# EAGLE design oak_pcb (EAGLE 7.2.0)
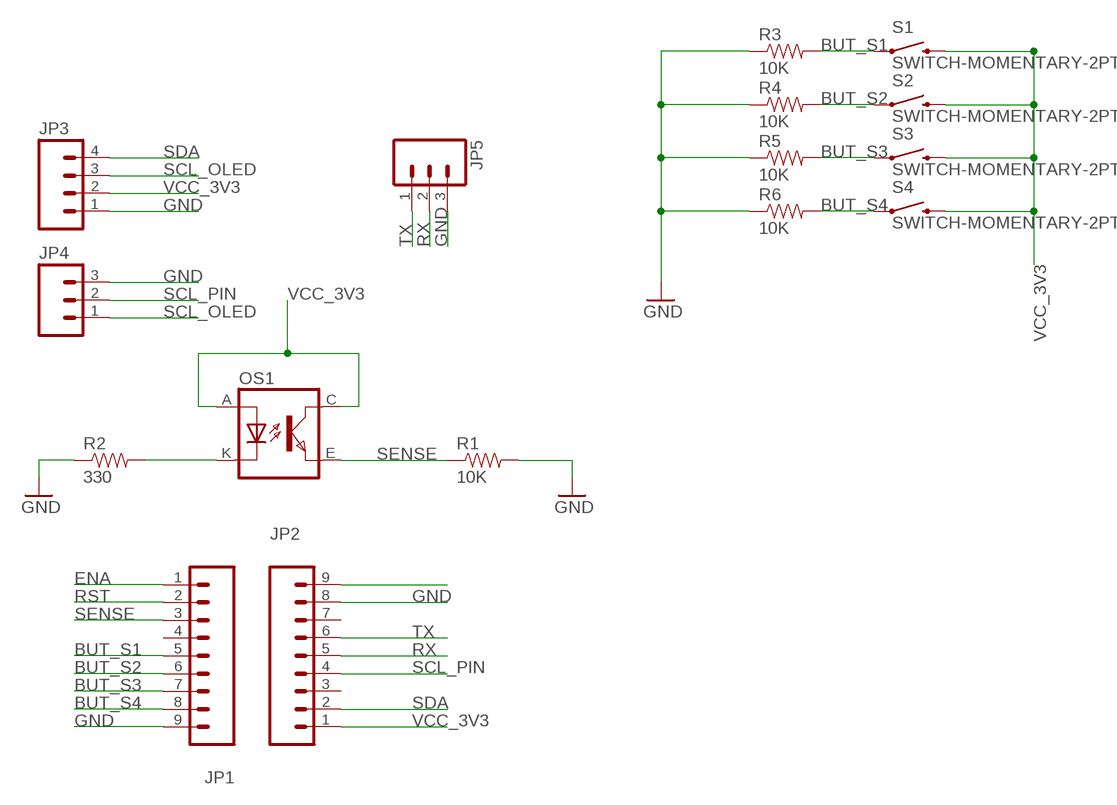
[diagram p0: schematic, sheet 1]

## Parts
JP1  M09LOCK  [1X09_LOCK]
JP2  M09LOCK  [1X09_LOCK]
JP3  M04LOCK  [1X04_LOCK]
JP4  M03LOCK  [1X03_LOCK]
JP5  M03LOCK  [1X03_LOCK]
OS1  TCRT5000  [TCRT5000]
R1  10K  RESISTORPTH-1/4W  [AXIAL-0.4]
R2  330  RESISTORPTH-1/4W  [AXIAL-0.4]
R3  10K  RESISTORPTH-1/4W  [AXIAL-0.4]
R4  10K  RESISTORPTH-1/4W  [AXIAL-0.4]
R5  10K  RESISTORPTH-1/4W  [AXIAL-0.4]
R6  10K  RESISTORPTH-1/4W  [AXIAL-0.4]
S1  SWITCH-MOMENTARY-2PTH  [TACTILE-PTH]
S2  SWITCH-MOMENTARY-2PTH  [TACTILE-PTH]
S3  SWITCH-MOMENTARY-2PTH  [TACTILE-PTH]
S4  SWITCH-MOMENTARY-2PTH  [TACTILE-PTH]

## Nets
BUT_S1: JP1.5 R3.P$2 S1.1
BUT_S2: JP1.6 R4.P$2 S2.1
BUT_S3: JP1.7 R5.P$2 S3.1
BUT_S4: JP1.8 R6.P$2 S4.1
ENA: JP1.1
GND: JP1.9 JP2.8 JP3.1 JP4.3 JP5.3 R1.P$2 R2.P$1 R3.P$1 R4.P$1 R5.P$1 R6.P$1
N$1: JP2.9
N$3: OS1.K(CATHODE) R2.P$2
RST: JP1.2
RX: JP2.5 JP5.2
SCL_OLED: JP3.3 JP4.1
SCL_PIN: JP2.4 JP4.2
SDA: JP2.2 JP3.4
SENSE: JP1.3 OS1.E(EMITTER) R1.P$1
TX: JP2.6 JP5.1
VCC_3V3: JP2.1 JP3.2 OS1.A(ANODE) OS1.C(COLLECTOR) S1.3 S2.3 S3.3 S4.3
Unconnected: JP1.4 JP2.3 JP2.7

## Library data of the parts
JP1 JP2 = SparkFun-Connectors:M09: Header 9 Standard 9-pin 0.1" header. Use with straight break away headers (SKU : PRT-00116), right angle break away headers (PRT-00553), swiss pins (PRT-00743), machine pins (PRT-00117), and female headers (PRT-00115).
JP3 = SparkFun-Connectors:M04: Header 4 Standard 4-pin 0.1" header. Use with straight break away headers (SKU : PRT-00116), right angle break away headers (PRT-00553), swiss pins (PRT-00743), machine pins (PRT-00117), and female headers (PRT-00115). Molex polarized connector foot print use with SKU : PRT-08231 with associated crimp pins and housings. 1MM SMD Version SKU: PRT-10208
JP4 JP5 = SparkFun-Connectors:M03: Header 3 Standard 3-pin 0.1" header. Use with straight break away headers (SKU : PRT-00116), right angle break away headers (PRT-00553), swiss pins (PRT-00743), machine pins (PRT-00117), and female headers (PRT-00115). Molex polarized connector foot print use with SKU : PRT-08232 with associated crimp pins and housings.
OS1 = tcrt5000:TCRT5000
R1-R6 = SparkFun-Passives:RESISTOR: Resistor Basic schematic elements and footprints for 0603, 1206, and PTH resistors.
S1-S4 = SparkFun-Electromechanical:SWITCH-MOMENTARY-2: Various NO switches- pushbuttons, reed, etc; PROD_ID: SWCH-08441

## Board
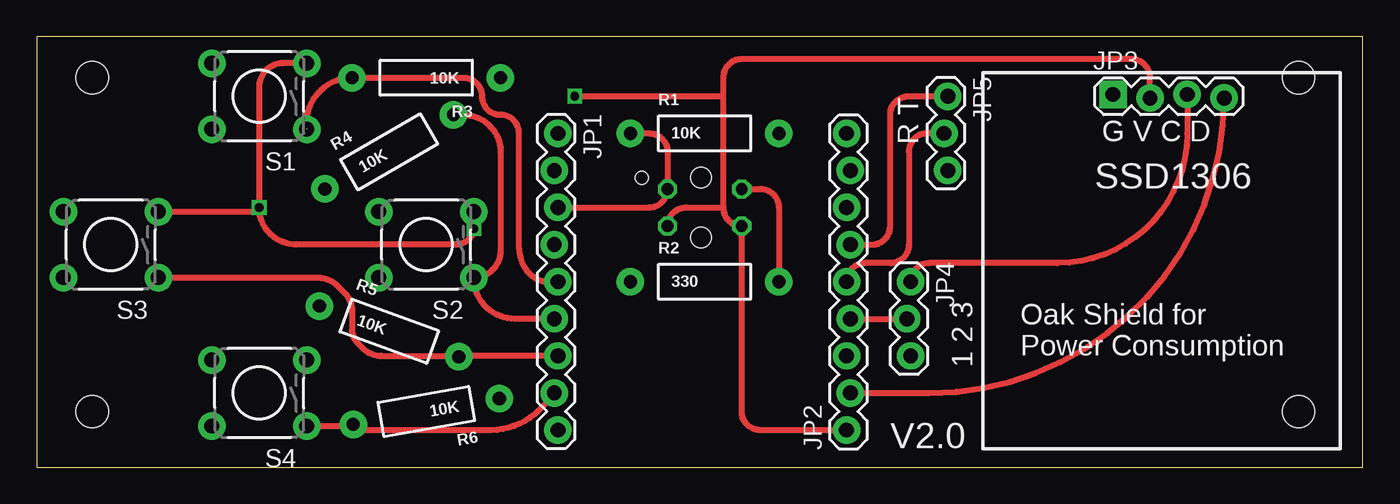
[diagram p1: board, top side]
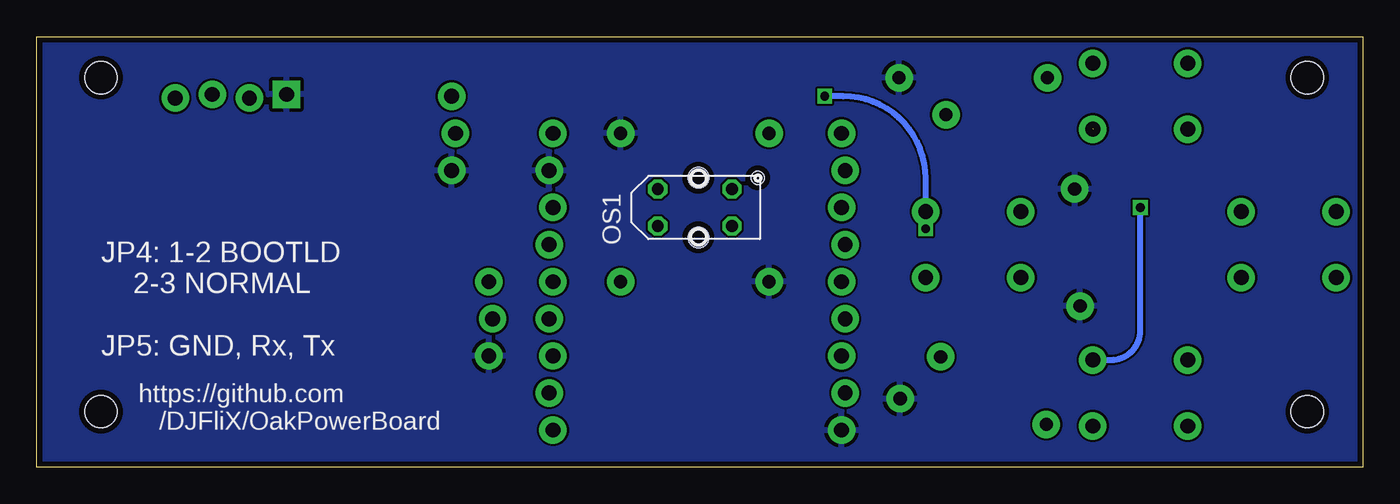
[diagram p2: board, bottom side, seen from below]

Size 90.77 x 29.49 mm. Coordinates in mm from the lower left corner, seen from the top.
Outline: 0,0 90.77,0 90.77,29.49 0,29.49 0,0
Copper layers (1*16): Top 0.035mm / dielectric 1.5mm / Bottom 0.035mm
Design rules "default *": minimum track width 6mil, minimum drill 13mil, track to track 6mil, track to pad 6mil, pad to pad 6mil, via to via 6mil, smd to smd 6mil, copper to edge 15mil, drill to drill 8mil, minimum pad ring 10mil, minimum via ring 8mil, stop-mask expansion 4mil, vias tented up to drill 0mil, thermal gap 10mil
Holes 2.2 mm at 3.81,3.81 3.81,26.67 86.36,26.67 86.36,3.81
Holes 1.4 mm at 45.48,15.74 45.48,19.82
Holes 0.9 mm at 41.41,19.82

### Footprints (pad centres in the part's own frame; a part is rotated, then mirrored left to right if it is on the bottom)
1X09_LOCK = drill 1.016 pad 1.88: 1 0,0.127; 2 2.54,-0.127; 3 5.08,0.127; 4 7.62,-0.127; 5 10.16,0.127; 6 12.7,-0.127; 7 15.24,0.127; 8 17.78,-0.127; 9 20.32,0.127
1X04_LOCK = drill 1.016 pad 1.88 square: 1 0,0.127 | drill 1.016 pad 1.88: 2 2.54,-0.127; 3 5.08,0.127; 4 7.62,-0.127
1X03_LOCK = drill 1.016 pad 1.88: 1 0,0.127; 2 2.54,-0.127; 3 5.08,0.127
TCRT5000 = drill 0.8 octagon: A -2.54,-1.27; C 2.54,-1.27; E 2.54,1.27; K -2.54,1.27
AXIAL-0.4 = drill 0.9 pad 1.88: P$1 -5.08,0; P$2 5.08,0
TACTILE-PTH = drill 1.016 pad 1.88: 1 -3.251,2.261; 2 3.251,2.261; 3 -3.251,-2.261; 4 3.251,-2.261

### Placement (x,y rotation side)
JP1  35.56,22.86 270 top
JP2  55.56,2.54 90 top
JP3  73.66,25.4 0 top
JP4  59.69,12.7 270 top
JP5  62.23,25.4 270 top
OS1  45.72,17.78 0 bottom
R1  45.72,22.86 0 top
R2  45.72,12.7 0 top
R3  26.67,26.67 180 top
R4  24.13,21.59 30 top
R5  24.13,9.3 340 top
R6  26.67,3.81 190 top
S1  15.24,25.4 180 top
S2  26.67,15.24 180 top
S3  5.08,15.24 180 top
S4  15.24,5.08 180 top

### Tracks (layer width: path | path; a pad name or v marks a point on that pad's centre or on a via)
BUT_S1  (1 unrouted)
  Top 0.406: JP1.5 35.03,12.7 arc-45 33.76,13.23 arc-45 33.02,15.02 33.02,22.86 arc90 31.75,24.13 arc-90 30.48,25.4 arc90 29.21,26.67 R3.P$2 arc90 18.49,23.57 18.49,23.2
BUT_S2
  Top 0.406: JP1.6 32.74,10.16 arc-90 S2.1 arc90 31.75,14.81 31.75,21.59 arc90 29.21,24.13 R4.P$2
BUT_S3
  Top 0.406: JP1.7 28.96,7.62 R5.P$2 28.85,7.62 23.6,7.62 arc-45 22.33,8.15 21.96,8.52 arc-45 21.59,9.42 21.59,10.69 arc45 21.06,11.96 20.58,12.44 arc45 19.28,12.98 S3.1
BUT_S4
  Top 0.406: JP1.8 35.43,4.95 34.36,3.88 arc-45 31.12,2.54 22.05,2.54 R6.P$2 21.56,2.82 S4.1
GND
  pour Bottom: 0,29.21 90.17,29.21 90.17,0 0,0
N$3
  Top 0.406: OS1.K 49.53,19.05 arc-90 50.8,17.78 R2.P$2
RX
  Top 0.406: JP5.2 60.96,22.86 arc90 59.69,21.59 59.69,15.24 arc-90 58.42,13.97 56.7,13.97 arc90 JP2.5
SCL_OLED
  Top 0.406: JP3.3 78.74,22.86 arc-90 69.85,13.97 61.09,13.97 arc90 JP4.1
SCL_PIN
  Top 0.406: JP2.4 JP4.2
SDA
  Top 0.406: JP2.2 61.09,5.08 arc90 JP3.4
SENSE
  Top 0.406: JP1.3 41.91,17.78 arc90 OS1.E 43.18,21.59 arc90 41.91,22.86 R1.P$1
TX
  Top 0.406: JP2.6 57.15,15.24 arc90 58.42,16.51 58.42,24.13 arc-90 59.69,25.4 JP5.1
VCC_3V3  (via drill 0.6)
  Top 0.406: S1.3 16.85,27.66 arc90 15.24,26.05 v15.24,17.78 | S2.3 v29.92,16.33 arc-45 29.66,15.69 29.58,15.61 arc-45 28.68,15.24 17.78,15.24 arc-90 v15.24,17.78 | S3.3 14.8,17.5 arc45 15.08,17.62 v15.24,17.78 | JP3.2 76.2,26.67 arc90 74.93,27.94 48.26,27.94 arc90 46.99,26.67 46.99,25.4 | 46.99,25.4 46.99,17.78 | 46.99,17.78 arc90 OS1.A 48.26,3.81 arc90 49.53,2.54 JP2.1 | OS1.C arc-90 44.45,17.78 46.99,17.78 | v36.83,25.4 46.99,25.4
  Bottom 0.406: S4.3 17.24,7.34 arc-90 15.24,9.34 v15.24,17.78 | v29.92,16.33 29.92,19.76 arc-90 35.56,25.4 v36.83,25.4

### Text on the board
tPlace: SSD1306 | Oak Shield for / Power Consumption
tNames: R T | G V C D | 1 2 3 | V2.0
bNames: JP4: 1-2 BOOTLD / 2-3 NORMAL / / JP5: GND, Rx, Tx | https://github.com / /DJFliX/OakPowerBoard